# Altium project 转接板子.PrjPcb
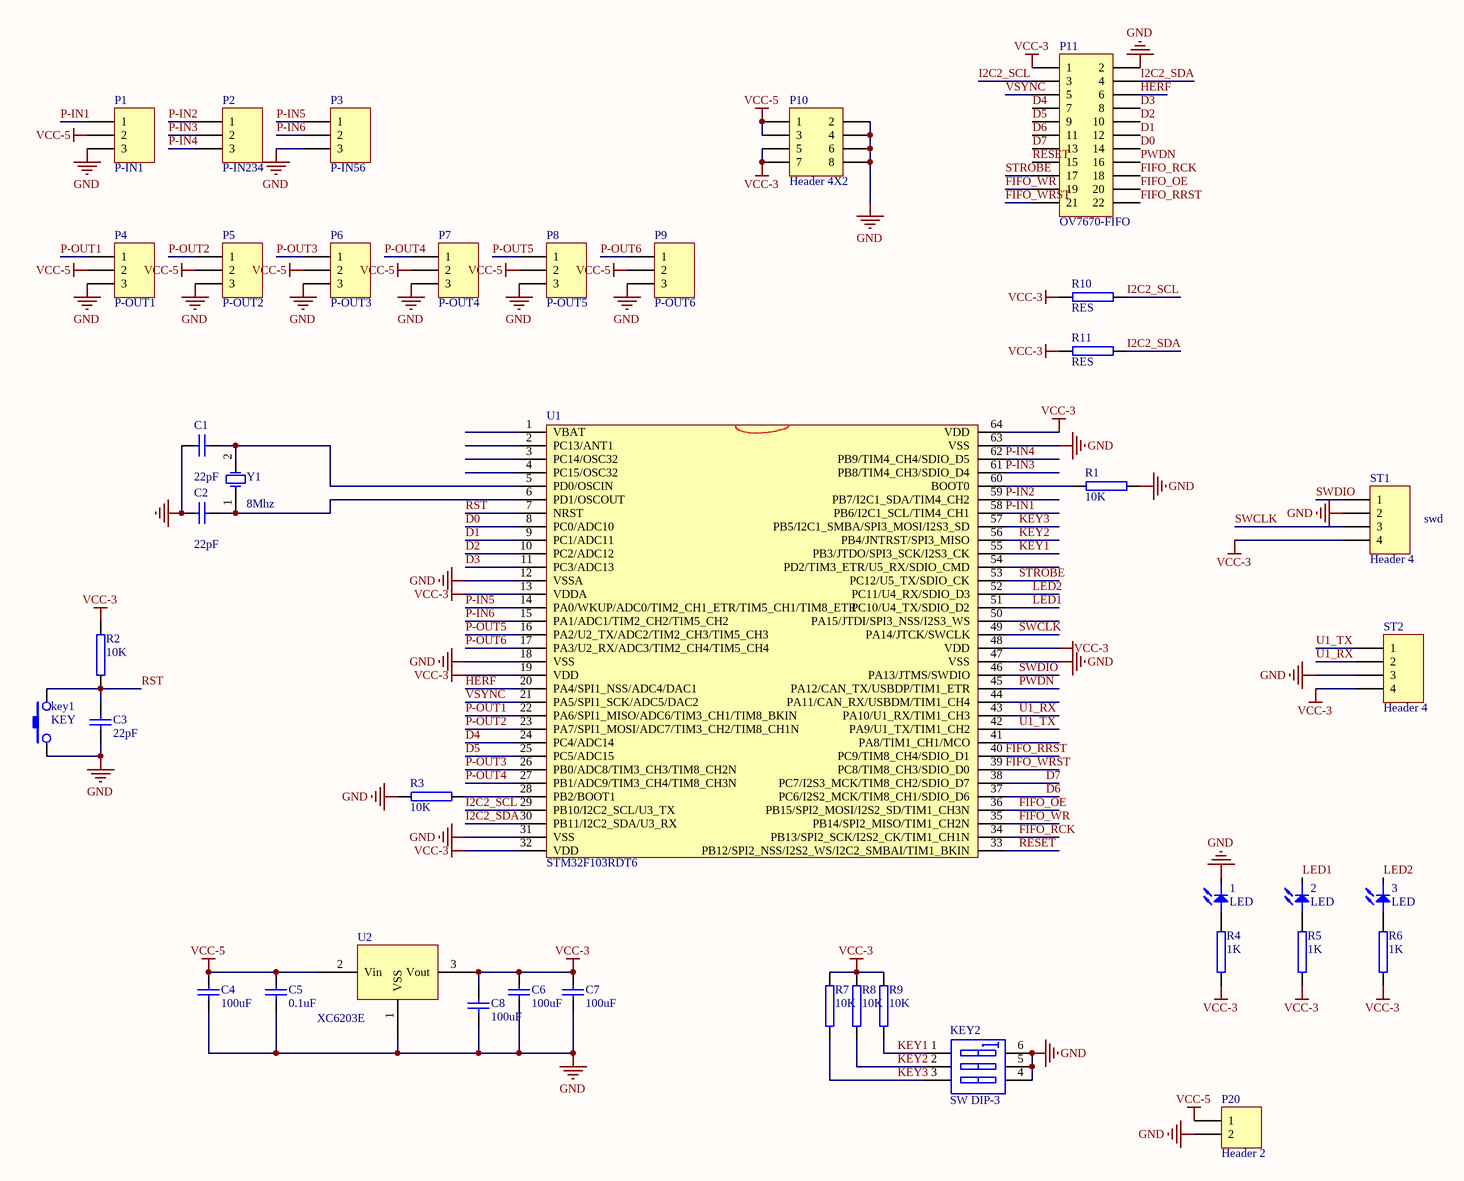
[diagram p0: Sheet1.SchDoc]
1 sheet, 41 parts. Net scope: global (net labels, ports and power ports of the same name join across sheets).
Board file: PCB1.PcbDoc

## Sheet Sheet1.SchDoc
size A3

### Parts
1  LED  [0603c]
2  LED  [0603c]
3  LED  [0603c]
C1  value 22pF  [0603c]  (hidden comment: cap)
C2  value 22pF  [0603c]  (hidden comment: cap)
C3  value 22pF  [0603c]  (hidden comment: cap)
C4  value 100uF  [0603c]  (hidden comment: cap)
C5  value 0.1uF  [0603c]  (hidden comment: cap)
C6  value 100uF  [0603c]  (hidden comment: cap)
C7  value 100uF  [0603c]  (hidden comment: cap)
C8  value 100uF  [0603c]  (hidden comment: cap)
key1  KEY  [7243]
KEY2  SW DIP-3  [DIP6]
P1  P-IN1  [HDR1X3]
P2  P-IN234  [HDR1X3]
P3  P-IN56  [HDR1X3]
P4  P-OUT1  [HDR1X3]
P5  P-OUT2  [HDR1X3]
P6  P-OUT3  [HDR1X3]
P7  P-OUT4  [HDR1X3]
P8  P-OUT5  [HDR1X3]
P9  P-OUT6  [HDR1X3]
P10  Header 4X2  [HDR2X4]
P11  OV7670-FIFO  [HDR2X11]
P20  Header 2  [HDR1X2]
R1  10K  [0603c]
R2  10K  [0603c]
R3  10K  [0603c]
R4  1K  [0603c]
R5  1K  [0603c]
R6  1K  [0603c]
R7  10K  [0603c]
R8  10K  [0603c]
R9  10K  [0603c]
R10  RES  [0603c]
R11  RES  [0603c]
ST1  Header 4  [HDR1X4]
ST2  Header 4  [HDR1X4]
U1  STM32F103RDT6  [LQFP64]
U2  XC6203E  [SOT-89]
Y1  5032xtal  [XTAL]  (value not drawn)

### Nets
GND: 1.K C1.1 C2.1 C3.1 C4.1 C5.1 C6.1 C7.1 C8.1 key1.1 KEY2.4(B3) KEY2.5(B2) KEY2.6(B1) P1.3 P3.3 P4.3 P5.3 P6.3 P7.3 P8.3 P9.3 P10.2 P10.4 P10.6 P10.8 P11.2 P20.2 R1.2 R3.2 ST1.2 ST2.3 U1.12(VSSA) U1.18(VSS) U1.31(VSS) U1.47(VSS) U1.63(VSS) U2.1(VSS)
VCC-3: C6.2 C7.2 C8.2 P10.5 P10.7 P11.1 R2.2 R4.1 R5.1 R6.1 R7.2 R8.2 R9.2 R10.1 R11.1 ST1.4 ST2.4 U1.13(VDDA) U1.19(VDD) U1.32(VDD) U1.48(VDD) U1.64(VDD) U2.3(Vout)
VCC-5: C4.2 C5.2 P1.2 P4.2 P5.2 P6.2 P7.2 P8.2 P9.2 P10.1 P10.3 P20.1 U2.2(Vin)
D0: P11.14 U1.8(PC0/ADC10)
D1: P11.12 U1.9(PC1/ADC11)
D2: P11.10 U1.10(PC2/ADC12)
D3: P11.8 U1.11(PC3/ADC13)
D4: P11.7 U1.24(PC4/ADC14)
D5: P11.9 U1.25(PC5/ADC15)
D6: P11.11 U1.37(PC6/I2S2_MCK/TIM8_CH1/SDIO_D6)
D7: P11.13 U1.38(PC7/I2S3_MCK/TIM8_CH2/SDIO_D7)
FIFO_OE: P11.20 U1.36(PB15/SPI2_MOSI/I2S2_SD/TIM1_CH3N)
FIFO_RCK: P11.18 U1.34(PB13/SPI2_SCK/I2S2_CK/TIM1_CH1N)
FIFO_RRST: P11.22 U1.40(PC9/TIM8_CH4/SDIO_D1)
FIFO_WR: P11.19 U1.35(PB14/SPI2_MISO/TIM1_CH2N)
FIFO_WRST: P11.21 U1.39(PC8/TIM8_CH3/SDIO_D0)
HERF: P11.6 U1.20(PA4/SPI1_NSS/ADC4/DAC1)
I2C2_SCL: P11.3 R10.2 U1.29(PB10/I2C2_SCL/U3_TX)
I2C2_SDA: P11.4 R11.2 U1.30(PB11/I2C2_SDA/U3_RX)
KEY1: KEY2.1(A1) R9.1 U1.55(PB3/JTDO/SPI3_SCK/I2S3_CK)
KEY2: KEY2.2(A2) R8.1 U1.56(PB4/JNTRST/SPI3_MISO)
KEY3: KEY2.3(A3) R7.1 U1.57(PB5/I2C1_SMBA/SPI3_MOSI/I2S3_SD)
LED1: 2.K U1.51(PC10/U4_TX/SDIO_D2)
LED2: 3.K U1.52(PC11/U4_RX/SDIO_D3)
P-IN1: P1.1 U1.58(PB6/I2C1_SCL/TIM4_CH1)
P-IN2: P2.1 U1.59(PB7/I2C1_SDA/TIM4_CH2)
P-IN3: P2.2 U1.61(PB8/TIM4_CH3/SDIO_D4)
P-IN4: P2.3 U1.62(PB9/TIM4_CH4/SDIO_D5)
P-IN5: P3.1 U1.14(PA0/WKUP/ADC0/TIM2_CH1_ETR/TIM5_CH1/TIM8_ETR)
P-IN6: P3.2 U1.15(PA1/ADC1/TIM2_CH2/TIM5_CH2)
P-OUT1: P4.1 U1.22(PA6/SPI1_MISO/ADC6/TIM3_CH1/TIM8_BKIN)
P-OUT2: P5.1 U1.23(PA7/SPI1_MOSI/ADC7/TIM3_CH2/TIM8_CH1N)
P-OUT3: P6.1 U1.26(PB0/ADC8/TIM3_CH3/TIM8_CH2N)
P-OUT4: P7.1 U1.27(PB1/ADC9/TIM3_CH4/TIM8_CH3N)
P-OUT5: P8.1 U1.16(PA2/U2_TX/ADC2/TIM2_CH3/TIM5_CH3)
P-OUT6: P9.1 U1.17(PA3/U2_RX/ADC3/TIM2_CH4/TIM5_CH4)
PWDN: P11.16 U1.45(PA12/CAN_TX/USBDP/TIM1_ETR)
RESET: P11.15 U1.33(PB12/SPI2_NSS/I2S2_WS/I2C2_SMBAI/TIM1_BKIN)
RST: C3.2 key1.2 R2.1 U1.7(NRST)
STROBE: P11.17 U1.53(PC12/U5_TX/SDIO_CK)
SWCLK: ST1.3 U1.49(PA14/JTCK/SWCLK)
SWDIO: ST1.1 U1.46(PA13/JTMS/SWDIO)
U1_RX: ST2.2 U1.43(PA10/U1_RX/TIM1_CH3)
U1_TX: ST2.1 U1.42(PA9/U1_TX/TIM1_CH2)
VSYNC: P11.5 U1.21(PA5/SPI1_SCK/ADC5/DAC2)
Net1_A: 1.A R4.2
Net2_A: 2.A R5.2
Net3_A: 3.A R6.2
NetC1_2: C1.2 U1.5(PD0/OSCIN) Y1.2(OSC2)
NetC2_2: C2.2 U1.6(PD1/OSCOUT) Y1.1(OSC1)
NetR1_1: R1.1 U1.60(BOOT0)
NetR3_1: R3.1 U1.28(PB2/BOOT1)

Not connected (* = marked no-connect by the designer): U1 1(VBAT) 2(PC13/ANT1) 3(PC14/OSC32) 4(PC15/OSC32) 41(PA8/TIM1_CH1/MCO) 44(PA11/CAN_RX/USBDM/TIM1_CH4) 50(PA15/JTDI/SPI3_NSS/I2S3_WS) 54(PD2/TIM3_ETR/U5_RX/SDIO_CMD)

### Notes on the sheet
- swd
- (in symbol 5032xtal) 8Mhz

### Library data of the parts
1-3 = LED: pin to pad: A>1 K>2
KEY2 = SW DIP-3: DIP Switch
P1-P9 = MHDR1X3: Header, 3-Pin; LatestRevisionDate: 17-Jul-2002; LatestRevisionNote: Re-released for DXP Platform.; Publisher: Altium Limited
P10 = Header 4X2: Header, 4-Pin, Dual row; LatestRevisionDate: 17-Jul-2002; LatestRevisionNote: Re-released for DXP Platform.; Publisher: Altium Limited
P11 = Header 11X2: Header, 11-Pin, Dual row; LatestRevisionDate: 17-Jul-2002; LatestRevisionNote: Re-released for DXP Platform.; Publisher: Altium Limited
P20 = Header 2: Header, 2-Pin; LatestRevisionDate: 17-Jul-2002; LatestRevisionNote: Re-released for DXP Platform.; Publisher: Altium Limited
R1-R9 = RES
ST1 ST2 = Header 4: Header, 4-Pin; LatestRevisionDate: 17-Jul-2002; LatestRevisionNote: Re-released for DXP Platform.; Publisher: Altium Limited
U2 = XC6203